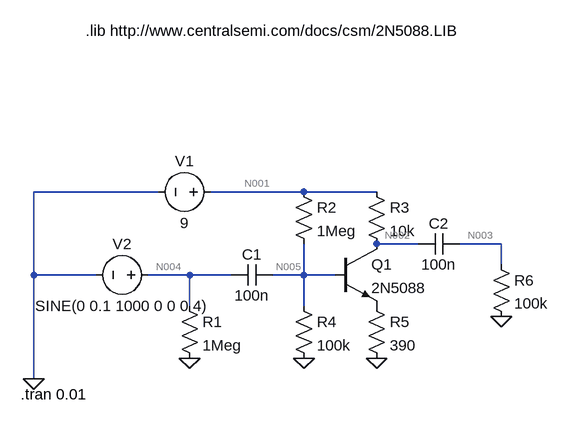
[diagram p0: schematic Draft1.asc]
Draft1.asc, the LTspice schematic file:
Version 4
SHEET 1 1488 680
WIRE -272 -48 -464 -48
WIRE -48 -48 -192 -48
WIRE 64 -48 -48 -48
WIRE 128 32 64 32
WIRE 256 32 192 32
WIRE 256 64 256 32
WIRE -464 80 -464 -48
WIRE -368 80 -464 80
WIRE -224 80 -288 80
WIRE -160 80 -224 80
WIRE -48 80 -48 32
WIRE -48 80 -96 80
WIRE 0 80 -48 80
WIRE -224 128 -224 80
WIRE -48 128 -48 80
WIRE -464 240 -464 80
FLAG -224 208 0
FLAG -48 208 0
FLAG 64 208 0
FLAG -464 240 0
FLAG 256 144 0
SYMBOL npn 0 32 R0
SYMATTR InstName Q1
SYMATTR Value 2N5088
SYMBOL res -240 112 R0
SYMATTR InstName R1
SYMATTR Value 1Meg
SYMBOL res -64 -64 R0
SYMATTR InstName R2
SYMATTR Value 1Meg
SYMBOL res 48 -64 R0
SYMATTR InstName R3
SYMATTR Value 10k
SYMBOL res -64 112 R0
SYMATTR InstName R4
SYMATTR Value 100k
SYMBOL res 48 112 R0
SYMATTR InstName R5
SYMATTR Value 390
SYMBOL cap -96 64 R90
WINDOW 0 0 32 VBottom 2
WINDOW 3 32 32 VTop 2
SYMATTR InstName C1
SYMATTR Value 100n
SYMBOL cap 192 16 R90
WINDOW 0 0 32 VBottom 2
WINDOW 3 32 32 VTop 2
SYMATTR InstName C2
SYMATTR Value 100n
SYMBOL voltage -176 -48 R90
WINDOW 0 -32 56 VBottom 2
WINDOW 3 32 56 VTop 2
WINDOW 123 0 0 Left 0
WINDOW 39 0 0 Left 0
SYMATTR InstName V1
SYMATTR Value 9
SYMBOL voltage -272 80 R90
WINDOW 0 -32 56 VBottom 2
WINDOW 3 32 56 VTop 2
WINDOW 123 0 0 Left 0
WINDOW 39 0 0 Left 0
SYMATTR InstName V2
SYMATTR Value SINE(0 0.1 1000 0 0 0 4)
SYMBOL res 240 48 R0
SYMATTR InstName R6
SYMATTR Value 100k
TEXT -384 -296 Left 2 !.lib http://www.centralsemi.com/docs/csm/2N5088.LIB
TEXT -484 264 Left 2 !.tran 0.01

The netlist it stands for:
* Draft1.asc
Q1 N002 N005 P001 0 2N5088
R1 N004 0 1Meg
R2 N001 N005 1Meg
R3 N001 N002 10k
R4 N005 0 100k
R5 P001 0 390
C1 N005 N004 100n
C2 N003 N002 100n
V1 N001 0 9
V2 N004 0 SINE(0 0.1 1000 0 0 0 4)
R6 N003 0 100k
.model NPN NPN
.model PNP PNP
.lib standard.bjt
.lib http://www.centralsemi.com/docs/csm/2N5088.LIB
.tran 0.01
.backanno
.end

* Results of the author's LTspice run, read from the files saved beside the schematic
* Operating Point, zero values left out:
*   V(n002) = 4.885 V
*   V(n005) = 757.4 mV
*   V(p001) = 160.7 mV
*   V(n001) = 9 V
*   Ic(Q1) = 411.5 µA
*   Ib(Q1) = 668.3 nA
*   Ie(Q1) = -412.2 µA
*   I(R5) = 412.2 µA
*   I(R4) = 7.574 µA
*   I(R3) = 411.5 µA
*   I(R2) = 8.243 µA
*   I(V1) = -419.7 µA
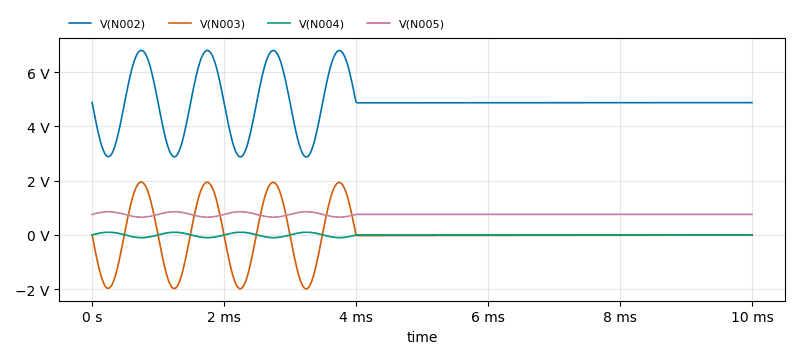
[diagram p1: Transient Analysis of Draft1.asc, plotted from the saved traces]
* Transient Analysis, 1 run:
*   V(N002): min 2.875 V, max 6.806 V, average 4.878 V, rms 4.957 V, last 4.879 V
*   V(N003): min -1.986 V, max 1.95 V, average 1.146 mV, rms 880.5 mV, last -6.883 mV
*   V(N004): min -99.95 mV, max 100 mV, average -665.3 nV, rms 44.72 mV, last 0 V
*   V(N005): min 655.6 mV, max 855.4 mV, average 756.9 mV, rms 758.2 mV, last 757.7 mV